# Altium schematic sheet 88E1512_1000M_SFP.SchDoc
size A3
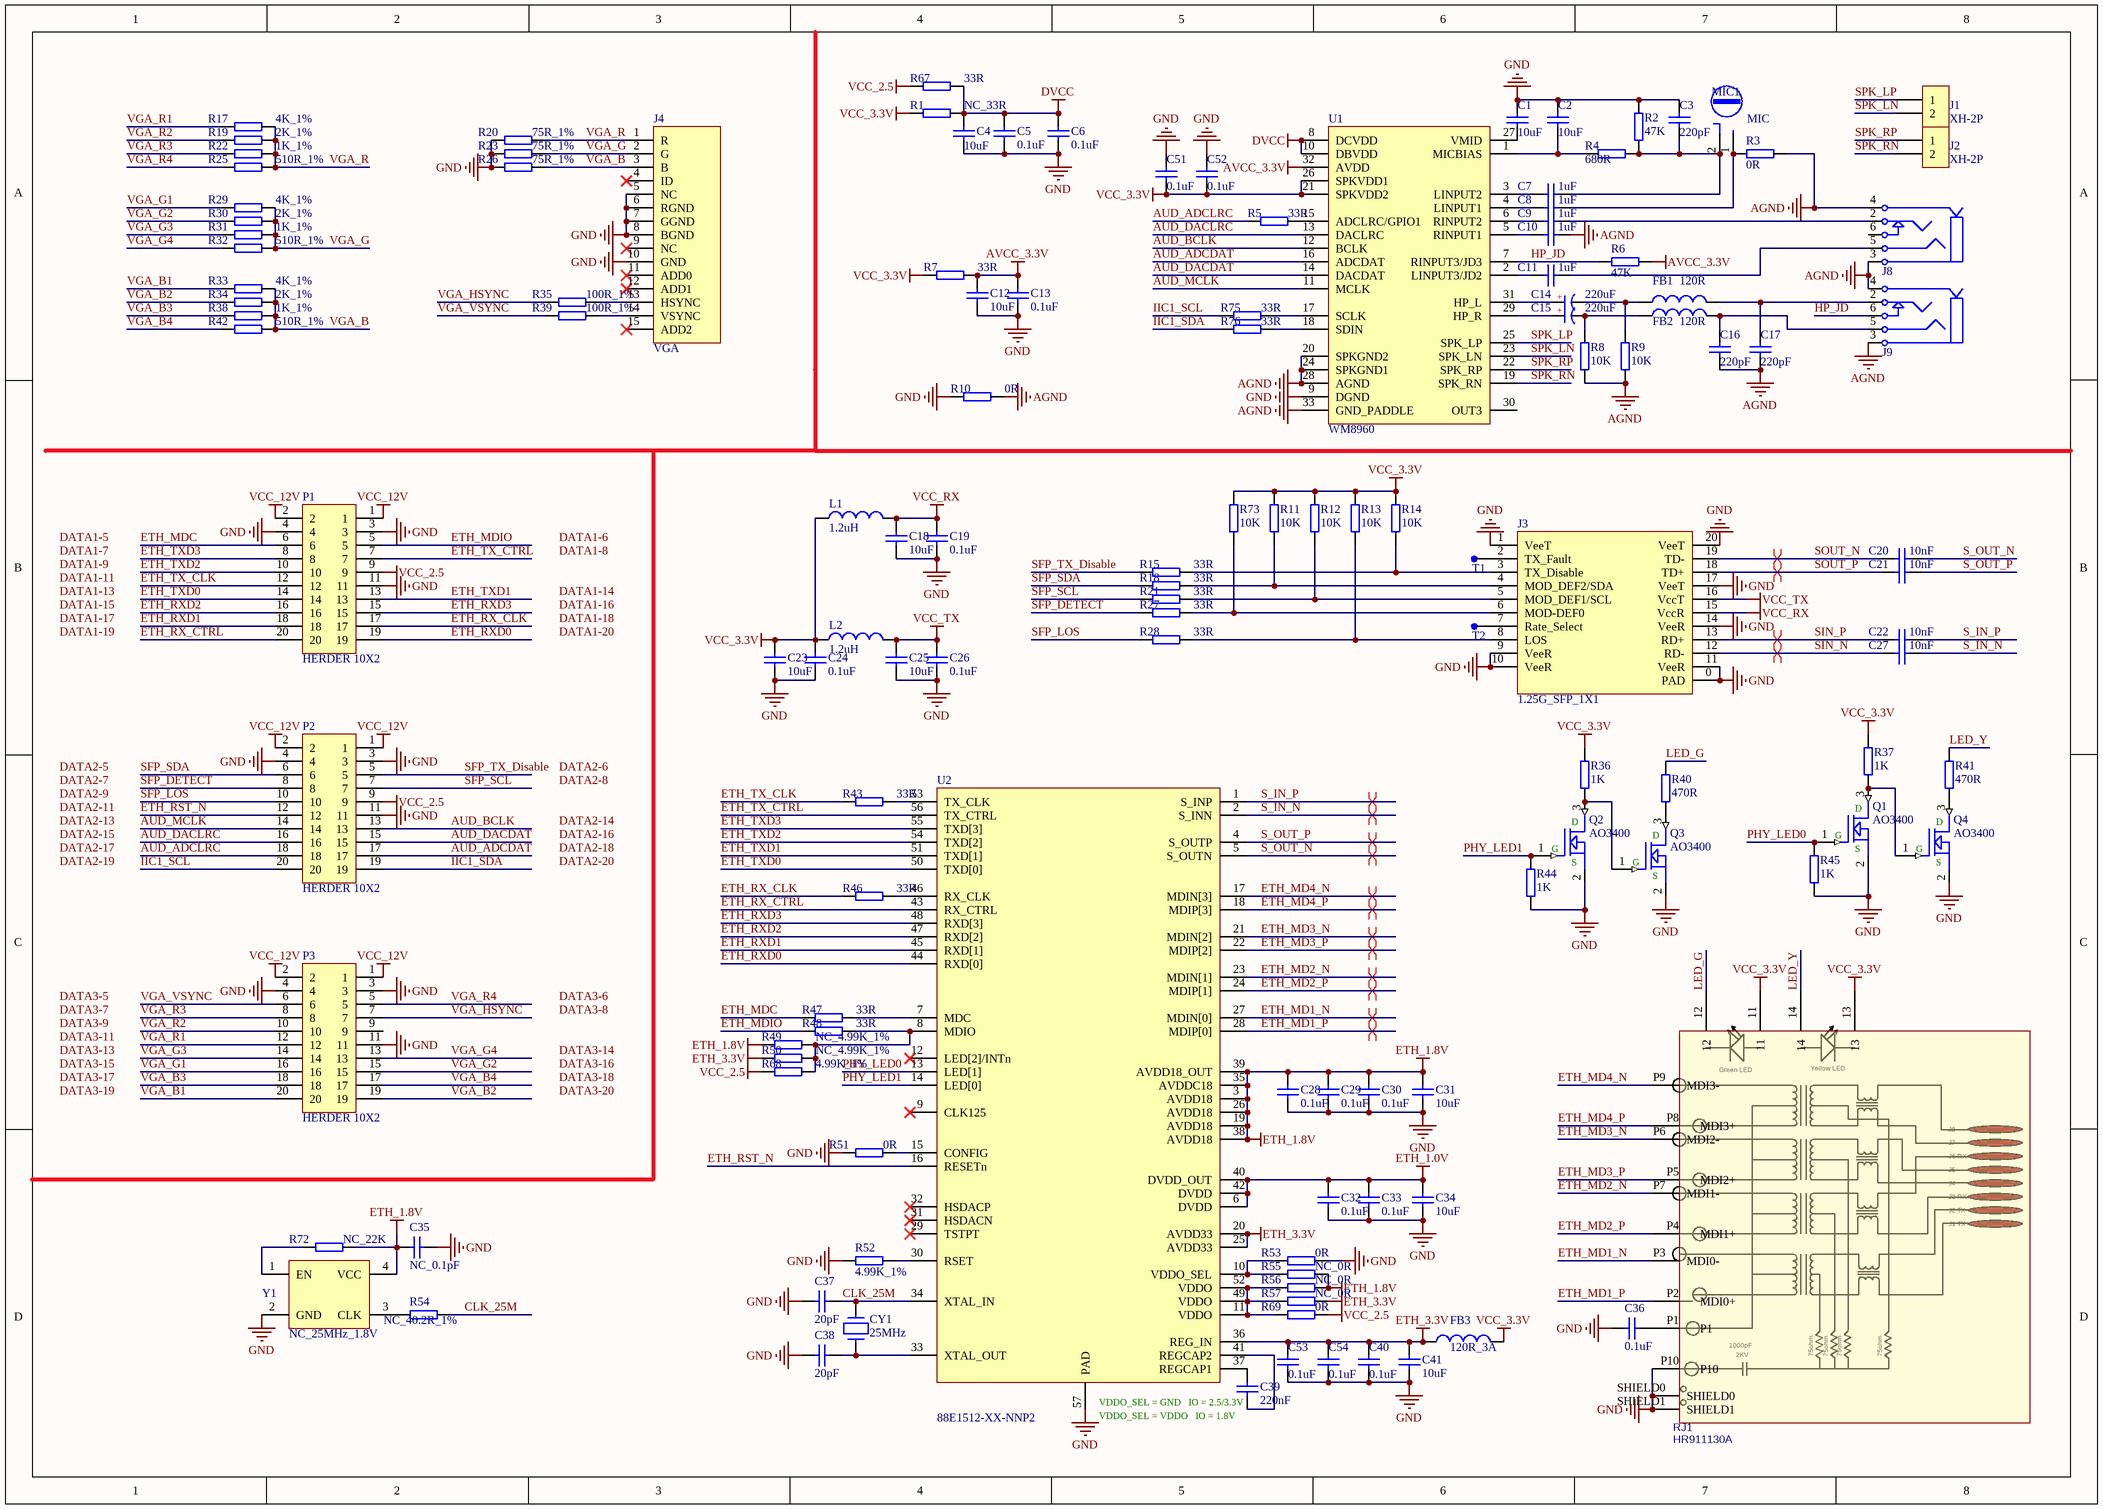
[diagram p0: 88E1512_1000M_SFP.SchDoc]

## Parts
C1  CC41-0603-22pF  [0402C]  (value not drawn)
C2  CC41-0603-22pF  [0402C]  (value not drawn)
C3  CC41-0603-22pF  [0402C]  (value not drawn)
C4  10uF  [0402C]
C5  CC41-0603-22pF  [0402C]  (value not drawn)
C6  CC41-0603-22pF  [0402C]  (value not drawn)
C7  CC41-0603-22pF  [0402C]  (value not drawn)
C8  CC41-0603-22pF  [0402C]  (value not drawn)
C9  CC41-0603-22pF  [0402C]  (value not drawn)
C10  CC41-0603-22pF  [0402C]  (value not drawn)
C11  CC41-0603-22pF  [0402C]  (value not drawn)
C12  CC41-0603-22pF  [0402C]  (value not drawn)
C13  CC41-0603-22pF  [0402C]  (value not drawn)
C14  220uF  [CM D(6.3*5.4)]
C15  220uF  [CM D(6.3*5.4)]
C16  CC41-0603-22pF  [0402C]  (value not drawn)
C17  CC41-0603-22pF  [0402C]  (value not drawn)
C18  CC41-0603-22pF  [0402C]  (value not drawn)
C19  CC41-0603-22pF  [0402C]  (value not drawn)
C20  10nF  [0402C]
C21  10nF  [0402C]
C22  10nF  [0402C]
C23  CC41-0603-22pF  [0402C]  (value not drawn)
C24  CC41-0603-22pF  [0402C]  (value not drawn)
C25  CC41-0603-22pF  [0402C]  (value not drawn)
C26  CC41-0603-22pF  [0402C]  (value not drawn)
C27  10nF  [0402C]
C28  CC41-0603-22pF  [0402C]  (value not drawn)
C29  CC41-0603-22pF  [0402C]  (value not drawn)
C30  CC41-0603-22pF  [0402C]  (value not drawn)
C31  CC41-0603-22pF  [0402C]  (value not drawn)
C32  CC41-0603-22pF  [0402C]  (value not drawn)
C33  CC41-0603-22pF  [0402C]  (value not drawn)
C34  CC41-0603-22pF  [0402C]  (value not drawn)
C35  CC41-0603-22pF  [0402C]  (value not drawn)
C36  CC41-0603-22pF  [0402C]  (value not drawn)
C37  CC41-0603-22pF  [0402C]  (value not drawn)
C38  CC41-0603-22pF  [0402C]  (value not drawn)
C39  CC41-0603-22pF  [0402C]  (value not drawn)
C40  CC41-0603-22pF  [0402C]  (value not drawn)
C41  CC41-0603-22pF  [0402C]  (value not drawn)
C51  CC41-0603-22pF  [0402C]  (value not drawn)
C52  CC41-0603-22pF  [0402C]  (value not drawn)
C53  CC41-0603-22pF  [0402C]  (value not drawn)
C54  CC41-0603-22pF  [0402C]  (value not drawn)
CY1  25MHz  [HC-49S]
FB1  120R  [0603R]
FB2  120R  [0603R]
FB3  120R_3A  [0603R]
J1  XH-2P  [DG1282]
J2  XH-2P  [DG1282]
J3  1.25G_SFP_1X1  [1.25G_SFP_1X1]
J4  VGA  [VGA]
J8  PJ-327A  [PJ327A]  (value not drawn)
J9  PJ-327A  [PJ327A]  (value not drawn)
L1  1.2uH  [0603R]
L2  1.2uH  [0603R]
MIC1  MIC  [MIC-6022]
P1  HERDER 10X2  [HDR2X10_2.0]
P2  HERDER 10X2  [HDR2X10_2.0]
P3  HERDER 10X2  [HDR2X10_2.0]
Q1  AO3400  [SOT23]
Q2  AO3400  [SOT23]
Q3  AO3400  [SOT23]
Q4  AO3400  [SOT23]
R1  NC_33R  [0402R]
R2  47K  [0402R]
R3  0R  [0402R]
R4  680R  [0402R]
R5  33R  [0402R]
R6  47K  [0402R]
R7  33R  [0402R]
R8  10K  [0402R]
R9  10K  [0402R]
R10  0R  [0402R]
R11  10K  [0402R]
R12  10K  [0402R]
R13  10K  [0402R]
R14  10K  [0402R]
R15  33R  [0402R]
R17  4K_1%  [0402R]
R18  33R  [0402R]
R19  2K_1%  [0402R]
R20  75R_1%  [0402R]
R21  33R  [0402R]
R22  1K_1%  [0402R]
R23  75R_1%  [0402R]
R25  510R_1%  [0402R]
R26  75R_1%  [0402R]
R27  33R  [0402R]
R28  33R  [0402R]
R29  4K_1%  [0402R]
R30  2K_1%  [0402R]
R31  1K_1%  [0402R]
R32  510R_1%  [0402R]
R33  4K_1%  [0402R]
R34  2K_1%  [0402R]
R35  100R_1%  [0402R]
R36  1K  [0402R]
R37  1K  [0402R]
R38  1K_1%  [0402R]
R39  100R_1%  [0402R]
R40  470R  [0402R]
R41  470R  [0402R]
R42  510R_1%  [0402R]
R43  33R  [0402R]
R44  1K  [0402R]
R45  1K  [0402R]
R46  33R  [0402R]
R47  33R  [0402R]
R48  33R  [0402R]
R49  NC_4.99K_1%  [0402R]
R50  NC_4.99K_1%  [0402R]
R51  0R  [0402R]
R52  4.99K_1%  [0402R]
R53  0R  [0402R]
R54  NC_40.2R_1%  [0402R]
R55  NC_0R  [0402R]
R56  NC_0R  [0402R]
R57  NC_0R  [0402R]
R67  33R  [0402R]
R68  4.99K_1%  [0402R]
R69  0R  [0402R]
R72  NC_22K  [0402R]
R73  10K  [0402R]
R75  33R  [0402R]
R76  33R  [0402R]
RJ1  HR911130A  [RJ45-TH_HR911130A]
T1  TEST  [TEST]  (value not drawn)
T2  TEST  [TEST]  (value not drawn)
U1  WM8960  [QFN32_W8960]
U2  88E1512-XX-NNP2  [88E1512_QFN56]
Y1  NC_25MHz_1.8V  [3225]

## Nets
AGND: C10.1 C16.1 C17.1 J8.3 J8.4 J9.3 J9.4 R3.2 R8.1 R9.1 R10.1 U1.20(SPKGND2) U1.24(SPKGND1) U1.28(AGND) U1.33(GND_PADDLE)
AVCC_3.3V: C12.2 C13.2 R6.2 R7.1 U1.32(AVDD)
DVCC: C4.2 C5.2 C6.2 R1.1 R67.1 U1.8(DCVDD) U1.10(DBVDD)
ETH_1.0V: C32.2 C33.2 C34.2 U2.6(DVDD) U2.40(DVDD_OUT) U2.42(DVDD)
ETH_1.8V: C28.2 C29.2 C30.2 C31.2 C35.1 R49.2 R55.2 R56.2 R72.2 U2.3(AVDD18) U2.19(AVDD18) U2.26(AVDD18) U2.35(AVDDC18) U2.38(AVDD18) U2.39(AVDD18_OUT) Y1.4(VCC)
ETH_3.3V: C40.2 C41.2 C53.2 C54.2 FB3.1 R50.2 R57.2 U2.20(AVDD33) U2.25(AVDD33) U2.36(REG_IN)
GND: C1.2 C2.2 C3.2 C4.1 C5.1 C6.1 C12.1 C13.1 C18.1 C19.1 C23.1 C24.1 C25.1 C26.1 C28.1 C29.1 C30.1 C31.1 C32.1 C33.1 C34.1 C35.2 C36.2 C37.1 C38.1 C40.1 C41.1 C51.1 C52.1 C53.1 C54.1 J3.0(PAD) J3.1(VeeT) J3.9(VeeR) J3.10(VeeR) J3.11(VeeR) J3.14(VeeR) J3.17(VeeT) J3.20(VeeT) J4.5(NC) J4.6(RGND) J4.7(GGND) J4.8(BGND) J4.10(GND) P1.3 P1.4 P1.11 P2.3 P2.4 P2.11 P3.3 P3.4 P3.11 Q1.2 Q2.2 Q3.2 Q4.2 R2.1 R10.2 R20.1 R23.1 R26.1 R44.1 R45.1 R51.1 R52.1 R53.2 RJ1.P10 RJ1.SHIELD0 RJ1.SHIELD1 U1.9(DGND) U2.57(PAD) Y1.2(GND)
VCC_2.5: P1.9 P2.9 R67.2 R68.2 R69.2
VCC_3.3V: C23.2 C24.2 C51.2 C52.2 FB3.2 L1.1 L2.1 R1.2 R7.2 R11.2 R12.2 R13.2 R14.2 R36.2 R37.2 R73.2 RJ1.11 RJ1.13 U1.21(SPKVDD2) U1.26(SPKVDD1)
VCC_12V: P1.1 P1.2 P2.1 P2.2 P3.1 P3.2
VCC_RX: C18.2 C19.2 J3.15(VccR) L1.2
VCC_TX: C25.2 C26.2 J3.16(VccT) L2.2
AUD_ADCDAT: P2.17 U1.16(ADCDAT)
AUD_ADCLRC: P2.18 R5.2
AUD_BCLK: P2.13 U1.12(BCLK)
AUD_DACDAT: P2.15 U1.14(DACDAT)
AUD_DACLRC: P2.16 U1.13(DACLRC)
AUD_MCLK: P2.14 U1.11(MCLK)
CLK_25M: C37.2 CY1.2 R54.2 U2.34(XTAL_IN)
ETH_MD1_N: RJ1.P3(MDI0-) U2.27(MDIN[0])
ETH_MD1_P: RJ1.P2(MDI0+) U2.28(MDIP[0])
ETH_MD2_N: RJ1.P7(MDI1-) U2.23(MDIN[1])
ETH_MD2_P: RJ1.P4(MDI1+) U2.24(MDIP[1])
ETH_MD3_N: RJ1.P6(MDI2-) U2.21(MDIN[2])
ETH_MD3_P: RJ1.P5(MDI2+) U2.22(MDIP[2])
ETH_MD4_N: RJ1.P9(MDI3-) U2.17(MDIN[3])
ETH_MD4_P: RJ1.P8(MDI3+) U2.18(MDIP[3])
ETH_MDC: P1.6 R47.2
ETH_MDIO: P1.5 R48.2
ETH_RST_N: P2.12 U2.16(RESETn)
ETH_RX_CLK: P1.17 R46.2
ETH_RX_CTRL: P1.20 U2.43(RX_CTRL)
ETH_RXD0: P1.19 U2.44(RXD[0])
ETH_RXD1: P1.18 U2.45(RXD[1])
ETH_RXD2: P1.16 U2.47(RXD[2])
ETH_RXD3: P1.15 U2.48(RXD[3])
ETH_TX_CLK: P1.12 R43.2
ETH_TX_CTRL: P1.7 U2.56(TX_CTRL)
ETH_TXD0: P1.14 U2.50(TXD[0])
ETH_TXD1: P1.13 U2.51(TXD[1])
ETH_TXD2: P1.10 U2.54(TXD[2])
ETH_TXD3: P1.8 U2.55(TXD[3])
HP_JD: J9.6 R6.1 U1.7(RINPUT3/JD3)
IIC1_SCL: P2.20 R75.2
IIC1_SDA: P2.19 R76.2
LED_G: R40.1 RJ1.12
LED_Y: R41.1 RJ1.14
PHY_LED0: Q1.1 R45.2 U2.13(LED[1])
PHY_LED1: Q2.1 R44.2 U2.14(LED[0])
S_IN_N: C27.1 U2.2(S_INN)
S_IN_P: C22.1 U2.1(S_INP)
S_OUT_N: C20.1 U2.5(S_OUTN)
S_OUT_P: C21.1 U2.4(S_OUTP)
SFP_DETECT: P2.8 R27.2
SFP_LOS: P2.10 R28.2
SFP_SCL: P2.7 R21.2
SFP_SDA: P2.6 R18.2
SFP_TX_Disable: P2.5 R15.2
SIN_N: C27.2 J3.12(RD-)
SIN_P: C22.2 J3.13(RD+)
SOUT_N: C20.2 J3.19(TD-)
SOUT_P: C21.2 J3.18(TD+)
SPK_LN: J1.2 U1.23(SPK_LN)
SPK_LP: J1.1 U1.25(SPK_LP)
SPK_RN: J2.2 U1.19(SPK_RN)
SPK_RP: J2.1 U1.22(SPK_RP)
VGA_B: J4.3(B) R26.2 R33.1 R34.1 R38.1 R42.1
VGA_B1: P3.20 R33.2
VGA_B2: P3.19 R34.2
VGA_B3: P3.18 R38.2
VGA_B4: P3.17 R42.2
VGA_G: J4.2(G) R23.2 R29.1 R30.1 R31.1 R32.1
VGA_G1: P3.16 R29.2
VGA_G2: P3.15 R30.2
VGA_G3: P3.14 R31.2
VGA_G4: P3.13 R32.2
VGA_HSYNC: P3.7 R35.1
VGA_R: J4.1(R) R17.1 R19.1 R20.2 R22.1 R25.1
VGA_R1: P3.12 R17.2
VGA_R2: P3.10 R19.2
VGA_R3: P3.8 R22.2
VGA_R4: P3.5 R25.2
VGA_VSYNC: P3.6 R39.1
NetC1_1: C1.1 U1.27(VMID)
NetC2_1: C2.1 R4.2 U1.1(MICBIAS)
NetC3_1: C3.1 C7.1 MIC1.2(GND) R2.2 R4.1
NetC7_2: C7.2 U1.3(LINPUT2)
NetC8_1: C8.1 MIC1.1(VCC) R3.1
NetC8_2: C8.2 U1.4(LINPUT1)
NetC9_1: C9.1 J8.2
NetC9_2: C9.2 U1.6(RINPUT2)
NetC10_2: C10.2 U1.5(RINPUT1)
NetC11_1: C11.1 J8.5
NetC11_2: C11.2 U1.2(LINPUT3/JD2)
NetC14_1: C14.1(A) U1.31(HP_L)
NetC14_2: C14.2(K) FB1.1 R9.2
NetC15_1: C15.1(A) U1.29(HP_R)
NetC15_2: C15.2(K) FB2.1 R8.2
NetC16_2: C16.2 FB2.2 J9.5
NetC17_2: C17.2 FB1.2 J9.2
NetC36_1: C36.1 RJ1.P1
NetC38_2: C38.2 CY1.1 U2.33(XTAL_OUT)
NetC39_1: C39.1 U2.37(REGCAP1)
NetC39_2: C39.2 U2.41(REGCAP2)
NetJ3_2: J3.2(TX_Fault) T1.1
NetJ3_3: J3.3(TX_Disable) R14.1 R15.1
NetJ3_4: J3.4(MOD_DEF2/SDA) R11.1 R18.1
NetJ3_5: J3.5(MOD_DEF1/SCL) R12.1 R21.1
NetJ3_6: J3.6(MOD-DEF0) R27.1 R73.1
NetJ3_7: J3.7(Rate_Select) T2.1
NetJ3_8: J3.8(LOS) R13.1 R28.1
NetJ4_13: J4.13(HSYNC) R35.2
NetJ4_14: J4.14(VSYNC) R39.2
NetQ1_3: Q1.3 Q4.1 R37.1
NetQ2_3: Q2.3 Q3.1 R36.1
NetQ3_3: Q3.3 R40.2
NetQ4_3: Q4.3 R41.2
NetR5_1: R5.1 U1.15(ADCLRC/GPIO1)
NetR43_1: R43.1 U2.53(TX_CLK)
NetR46_1: R46.1 U2.46(RX_CLK)
NetR47_1: R47.1 U2.7(MDC)
NetR48_1: R48.1 R49.1 R50.1 R68.1 U2.8(MDIO)
NetR51_2: R51.2 U2.15(CONFIG)
NetR52_2: R52.2 U2.30(RSET)
NetR53_1: R53.1 R55.1 U2.10(VDDO_SEL)
NetR54_1: R54.1 Y1.3(CLK)
NetR56_1: R56.1 R57.1 R69.1 U2.11(VDDO) U2.49(VDDO) U2.52(VDDO)
NetR72_1: R72.1 Y1.1(EN)
NetR75_1: R75.1 U1.17(SCLK)
NetR76_1: R76.1 U1.18(SDIN)

Not connected (* = marked no-connect by the designer): J4 4(ID)* 9(NC)* 11(ADD0)* 12(ADD1)* 15(ADD2)*; J8 6; P3 9; U1 30(OUT3); U2 9(CLK125)* 12(LED[2]/INTn)* 29(TSTPT)* 31(HSDACN)* 32(HSDACP)*

## Layout directives
differential pair: ETH_MD1_N, ETH_MD1_P, ETH_MD2_N, ETH_MD2_P, ETH_MD3_N, ETH_MD3_P, ETH_MD4_N, ETH_MD4_P, S_IN_N, S_IN_P, S_OUT_N, S_OUT_P, SIN_N, SIN_P, SOUT_N, SOUT_P

## Notes on the sheet
- (near C39) VDDO_SEL = GND   IO = 2.5/3.3V
- VDDO_SEL = VDDO   IO = 1.8V
- Labels drawn without touching a wire or pin: DATA1-5, DATA1-6, DATA1-7, DATA1-8, DATA1-9, DATA1-11, DATA1-13, DATA1-14, DATA1-15, DATA1-16, DATA1-17, DATA1-18, DATA1-19, DATA1-20, DATA2-5, DATA2-6, DATA2-7, DATA2-8, DATA2-9, DATA2-11, DATA2-13, DATA2-14, DATA2-15, DATA2-16, DATA2-17, DATA2-18, DATA2-19, DATA2-20, DATA3-5, DATA3-6, DATA3-7, DATA3-8, DATA3-9, DATA3-11, DATA3-13, DATA3-14, DATA3-15, DATA3-16, DATA3-17, DATA3-18, DATA3-19, DATA3-20
- (in symbol C-CM) +
- (in symbol CC41-0603-22pF) 220nF; 10uF; 0.1uF; 20pF; NC_0.1pF; 220pF; 1uF
- (in symbol HR911130A) Green LED; Yellow LED; J8; J7; J6 RX-; J5; J4; J3 RX+; J2 TX-; J1 TX+; 1000pF; 75ohm; 2KV
- (in symbol MOS-N) D; G; S

## Library data of the parts
C1-C13 C16-C41 C51-C54 = CC41-0603-22pF: NPO贴片电容
C14 C15 = C-CM: 贴片电解电容; 版权归属: 源创客; BOM名称: 贴片电解电容; 学习资源: www.ooocke.com
CY1 = CRYES
FB1-FB3 L1 L2 = L-4.7uH-4D28
J1 J2 = CON2
Q1-Q4 = MOS-N
R1-R15 R17-R23 R25-R57 R67-R69 R72 R73 R75 R76 = RES1
RJ1 = HR911130A: BOM_Manufacturer: HANRUN; BOM_Supplier: LCSC; BOM_Manufacturer Part: HR911130A; BOM_Supplier Part: C54408; spicePre: R; spiceSymbolName: HR911130A
Y1 = 32.768KHz_3.3V: 3225 3.3V